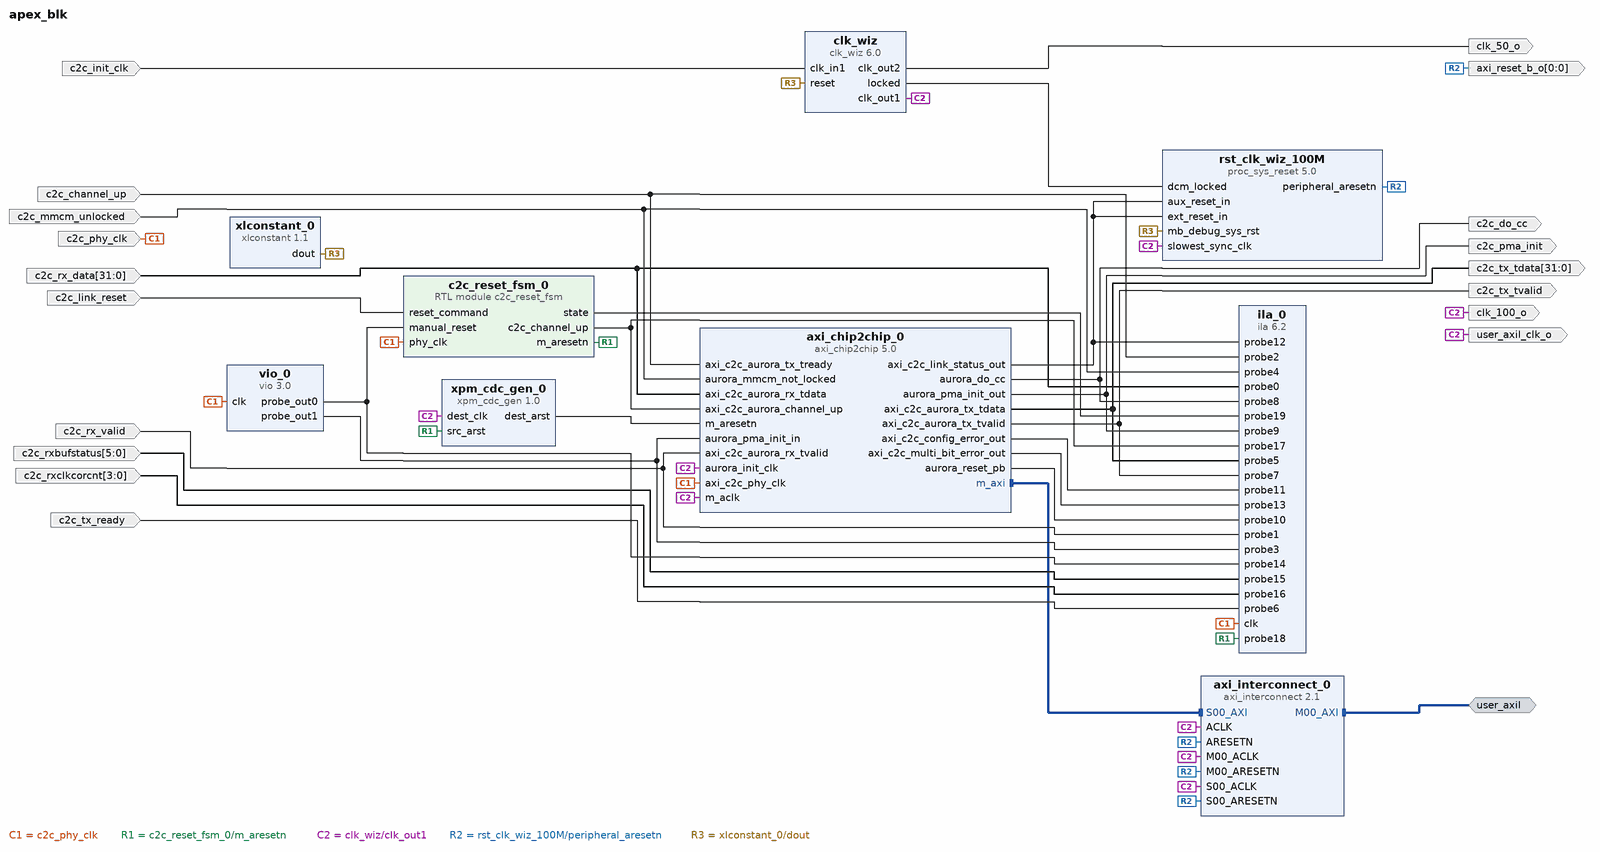
[diagram p0: block diagram of the top level]
# Vivado block design apex_blk, xcku15p-ffva1760-2-e, Vivado 2021.1
create_bd_design apex_blk

create_bd_intf_port -mode Master -vlnv xilinx.com:interface:aximm_rtl:1.0 user_axil
set_property -dict [list \
  CONFIG.ADDR_WIDTH 32 \
  CONFIG.DATA_WIDTH 32 \
  CONFIG.FREQ_HZ 100000000 \
  CONFIG.PROTOCOL AXI4LITE \
] [get_bd_intf_ports user_axil]
create_bd_port -dir O -type clk clk_50_o
create_bd_port -dir O -type clk user_axil_clk_o
set_property -dict {CONFIG.ASSOCIATED_BUSIF user_axil CONFIG.FREQ_HZ 100000000} [get_bd_ports user_axil_clk_o]
create_bd_port -dir O -from 0 -to 0 -type rst axi_reset_b_o
create_bd_port -dir O -type clk clk_100_o
create_bd_port -dir I c2c_link_reset
create_bd_port -dir I -type rst c2c_mmcm_unlocked
set_property -dict {CONFIG.POLARITY ACTIVE_HIGH} [get_bd_ports c2c_mmcm_unlocked]
create_bd_port -dir I -type clk c2c_init_clk
set_property -dict {CONFIG.FREQ_HZ 250000000} [get_bd_ports c2c_init_clk]
create_bd_port -dir I c2c_channel_up
create_bd_port -dir I -type clk c2c_phy_clk
set_property -dict {CONFIG.FREQ_HZ 93750000} [get_bd_ports c2c_phy_clk]
create_bd_port -dir I c2c_tx_ready
create_bd_port -dir I c2c_rx_valid
create_bd_port -dir I -from 31 -to 0 c2c_rx_data
create_bd_port -dir I -from 3 -to 0 c2c_rxclkcorcnt
create_bd_port -dir I -from 5 -to 0 c2c_rxbufstatus
create_bd_port -dir O c2c_do_cc
create_bd_port -dir O c2c_tx_tvalid
create_bd_port -dir O -from 31 -to 0 c2c_tx_tdata
create_bd_port -dir O -type rst c2c_pma_init

create_bd_cell -type ip -vlnv xilinx.com:ip:proc_sys_reset:5.0 rst_clk_wiz_100M
create_bd_cell -type ip -vlnv xilinx.com:ip:axi_chip2chip:5.0 axi_chip2chip_0
set_property -dict [list \
  CONFIG.C_ECC_ENABLE false \
  CONFIG.C_EN_AXI_LINK_HNDLR true \
  CONFIG.C_INTERFACE_MODE 1 \
  CONFIG.C_INTERFACE_TYPE 3 \
  CONFIG.C_MASTER_FPGA 0 \
  CONFIG.C_M_AXI_WUSER_WIDTH 0 \
] [get_bd_cells axi_chip2chip_0]
create_bd_cell -type ip -vlnv xilinx.com:ip:axi_interconnect:2.1 axi_interconnect_0
set_property -dict {CONFIG.NUM_MI 1} [get_bd_cells axi_interconnect_0]
create_bd_cell -type ip -vlnv xilinx.com:ip:clk_wiz:6.0 clk_wiz
set_property -dict [list \
  CONFIG.CLKIN1_JITTER_PS 40.0 \
  CONFIG.CLKOUT1_JITTER 134.506 \
  CONFIG.CLKOUT1_PHASE_ERROR 154.678 \
  CONFIG.CLKOUT2_JITTER 153.164 \
  CONFIG.CLKOUT2_PHASE_ERROR 154.678 \
  CONFIG.CLKOUT2_REQUESTED_OUT_FREQ 50 \
  CONFIG.CLKOUT2_USED true \
  CONFIG.MMCM_CLKFBOUT_MULT_F 24.000 \
  CONFIG.MMCM_CLKIN1_PERIOD 4.000 \
  CONFIG.MMCM_CLKIN2_PERIOD 10.0 \
  CONFIG.MMCM_CLKOUT0_DIVIDE_F 12.000 \
  CONFIG.MMCM_CLKOUT1_DIVIDE 24 \
  CONFIG.MMCM_DIVCLK_DIVIDE 5 \
  CONFIG.NUM_OUT_CLKS 2 \
  CONFIG.PRIM_IN_FREQ 250 \
] [get_bd_cells clk_wiz]
create_bd_cell -type ip -vlnv xilinx.com:ip:xlconstant:1.1 xlconstant_0
set_property -dict {CONFIG.CONST_VAL 0} [get_bd_cells xlconstant_0]
create_bd_cell -type module -reference c2c_reset_fsm c2c_reset_fsm_0
create_bd_cell -type ip -vlnv xilinx.com:ip:ila:6.2 ila_0
set_property -dict [list \
  CONFIG.C_ENABLE_ILA_AXI_MON false \
  CONFIG.C_INPUT_PIPE_STAGES 6 \
  CONFIG.C_MONITOR_TYPE Native \
  CONFIG.C_NUM_OF_PROBES 20 \
  CONFIG.C_PROBE0_WIDTH 32 \
  CONFIG.C_PROBE15_WIDTH 6 \
  CONFIG.C_PROBE16_WIDTH 4 \
  CONFIG.C_PROBE19_WIDTH 2 \
  CONFIG.C_PROBE5_WIDTH 32 \
] [get_bd_cells ila_0]
create_bd_cell -type ip -vlnv xilinx.com:ip:vio:3.0 vio_0
set_property -dict {CONFIG.C_NUM_PROBE_IN 0 CONFIG.C_NUM_PROBE_OUT 2} [get_bd_cells vio_0]
create_bd_cell -type ip -vlnv xilinx.com:ip:xpm_cdc_gen:1.0 xpm_cdc_gen_0
set_property -dict {CONFIG.CDC_TYPE xpm_cdc_async_rst CONFIG.WIDTH 1} [get_bd_cells xpm_cdc_gen_0]

# ---- connections ----

connect_bd_intf_net [get_bd_intf_pins axi_interconnect_0/S00_AXI] [get_bd_intf_pins axi_chip2chip_0/m_axi]
connect_bd_intf_net [get_bd_intf_ports user_axil] [get_bd_intf_pins axi_interconnect_0/M00_AXI]
connect_bd_net -net axi_c2c_config_error_out [get_bd_pins axi_chip2chip_0/axi_c2c_config_error_out] [get_bd_pins ila_0/probe11]
connect_bd_net -net axi_c2c_link_status_out [get_bd_pins axi_chip2chip_0/axi_c2c_link_status_out] \
  [get_bd_pins rst_clk_wiz_100M/ext_reset_in] [get_bd_pins rst_clk_wiz_100M/aux_reset_in] [get_bd_pins ila_0/probe12]
connect_bd_net -net axi_c2c_multi_bit_error_out [get_bd_pins axi_chip2chip_0/axi_c2c_multi_bit_error_out] [get_bd_pins ila_0/probe13]
connect_bd_net [get_bd_pins axi_chip2chip_0/aurora_do_cc] [get_bd_ports c2c_do_cc] [get_bd_pins ila_0/probe8]
connect_bd_net [get_bd_pins axi_chip2chip_0/aurora_pma_init_out] [get_bd_ports c2c_pma_init] [get_bd_pins ila_0/probe9]
connect_bd_net [get_bd_pins axi_chip2chip_0/aurora_reset_pb] [get_bd_pins ila_0/probe10]
connect_bd_net [get_bd_pins axi_chip2chip_0/axi_c2c_aurora_tx_tdata] [get_bd_ports c2c_tx_tdata] [get_bd_pins ila_0/probe5]
connect_bd_net [get_bd_pins axi_chip2chip_0/axi_c2c_aurora_tx_tvalid] [get_bd_ports c2c_tx_tvalid] [get_bd_pins ila_0/probe7]
connect_bd_net [get_bd_ports c2c_channel_up] [get_bd_pins axi_chip2chip_0/axi_c2c_aurora_tx_tready] [get_bd_pins ila_0/probe2]
connect_bd_net [get_bd_ports c2c_init_clk] [get_bd_pins clk_wiz/clk_in1]
connect_bd_net [get_bd_ports c2c_link_reset] [get_bd_pins c2c_reset_fsm_0/reset_command]
connect_bd_net [get_bd_ports c2c_mmcm_unlocked] [get_bd_pins axi_chip2chip_0/aurora_mmcm_not_locked] [get_bd_pins ila_0/probe4]
connect_bd_net [get_bd_ports c2c_phy_clk] \
  [get_bd_pins c2c_reset_fsm_0/phy_clk] [get_bd_pins axi_chip2chip_0/axi_c2c_phy_clk] [get_bd_pins ila_0/clk] \
  [get_bd_pins vio_0/clk]
connect_bd_net [get_bd_pins c2c_reset_fsm_0/c2c_channel_up] [get_bd_pins axi_chip2chip_0/axi_c2c_aurora_channel_up] [get_bd_pins ila_0/probe17]
connect_bd_net [get_bd_pins c2c_reset_fsm_0/m_aresetn] [get_bd_pins ila_0/probe18] [get_bd_pins xpm_cdc_gen_0/src_arst]
connect_bd_net [get_bd_pins c2c_reset_fsm_0/state] [get_bd_pins ila_0/probe19]
connect_bd_net [get_bd_ports c2c_rx_data] [get_bd_pins axi_chip2chip_0/axi_c2c_aurora_rx_tdata] [get_bd_pins ila_0/probe0]
connect_bd_net [get_bd_ports c2c_rx_valid] [get_bd_pins axi_chip2chip_0/axi_c2c_aurora_rx_tvalid] [get_bd_pins ila_0/probe1]
connect_bd_net [get_bd_ports c2c_rxbufstatus] [get_bd_pins ila_0/probe15]
connect_bd_net [get_bd_ports c2c_rxclkcorcnt] [get_bd_pins ila_0/probe16]
connect_bd_net [get_bd_ports c2c_tx_ready] [get_bd_pins ila_0/probe6]
connect_bd_net [get_bd_pins clk_wiz/clk_out1] \
  [get_bd_pins axi_chip2chip_0/m_aclk] [get_bd_pins axi_interconnect_0/ACLK] [get_bd_pins axi_interconnect_0/S00_ACLK] \
  [get_bd_ports clk_100_o] [get_bd_ports user_axil_clk_o] [get_bd_pins rst_clk_wiz_100M/slowest_sync_clk] \
  [get_bd_pins axi_chip2chip_0/aurora_init_clk] [get_bd_pins axi_interconnect_0/M00_ACLK] \
  [get_bd_pins xpm_cdc_gen_0/dest_clk]
connect_bd_net [get_bd_pins clk_wiz/clk_out2] [get_bd_ports clk_50_o]
connect_bd_net [get_bd_pins clk_wiz/locked] [get_bd_pins rst_clk_wiz_100M/dcm_locked]
connect_bd_net [get_bd_pins rst_clk_wiz_100M/peripheral_aresetn] \
  [get_bd_ports axi_reset_b_o] [get_bd_pins axi_interconnect_0/ARESETN] [get_bd_pins axi_interconnect_0/S00_ARESETN] \
  [get_bd_pins axi_interconnect_0/M00_ARESETN]
connect_bd_net [get_bd_pins vio_0/probe_out1] [get_bd_pins axi_chip2chip_0/aurora_pma_init_in] [get_bd_pins ila_0/probe3]
connect_bd_net -net xlconstant_1_dout [get_bd_pins xlconstant_0/dout] [get_bd_pins rst_clk_wiz_100M/mb_debug_sys_rst] [get_bd_pins clk_wiz/reset]
connect_bd_net -net xlconstant_1_dout1 [get_bd_pins vio_0/probe_out0] [get_bd_pins c2c_reset_fsm_0/manual_reset] [get_bd_pins ila_0/probe14]
connect_bd_net [get_bd_pins xpm_cdc_gen_0/dest_arst] [get_bd_pins axi_chip2chip_0/m_aresetn]
set_property HDL_ATTRIBUTE.DEBUG true [get_bd_nets axi_c2c_config_error_out]
set_property HDL_ATTRIBUTE.MARK_DEBUG true [get_bd_nets axi_c2c_config_error_out]
set_property HDL_ATTRIBUTE.DEBUG true [get_bd_nets axi_c2c_link_status_out]
set_property HDL_ATTRIBUTE.MARK_DEBUG true [get_bd_nets axi_c2c_link_status_out]
set_property HDL_ATTRIBUTE.DEBUG true [get_bd_nets axi_c2c_multi_bit_error_out]
set_property HDL_ATTRIBUTE.MARK_DEBUG true [get_bd_nets axi_c2c_multi_bit_error_out]

# ---- address map ----
assign_bd_address -offset 0x00000000 -range 64M -target_address_space [get_bd_addr_spaces axi_chip2chip_0/MAXI] [get_bd_addr_segs user_axil/Reg]

validate_bd_design
save_bd_design
